# EAGLE design MFOS_NT_eurorack_v2 (EAGLE 7.3.0)
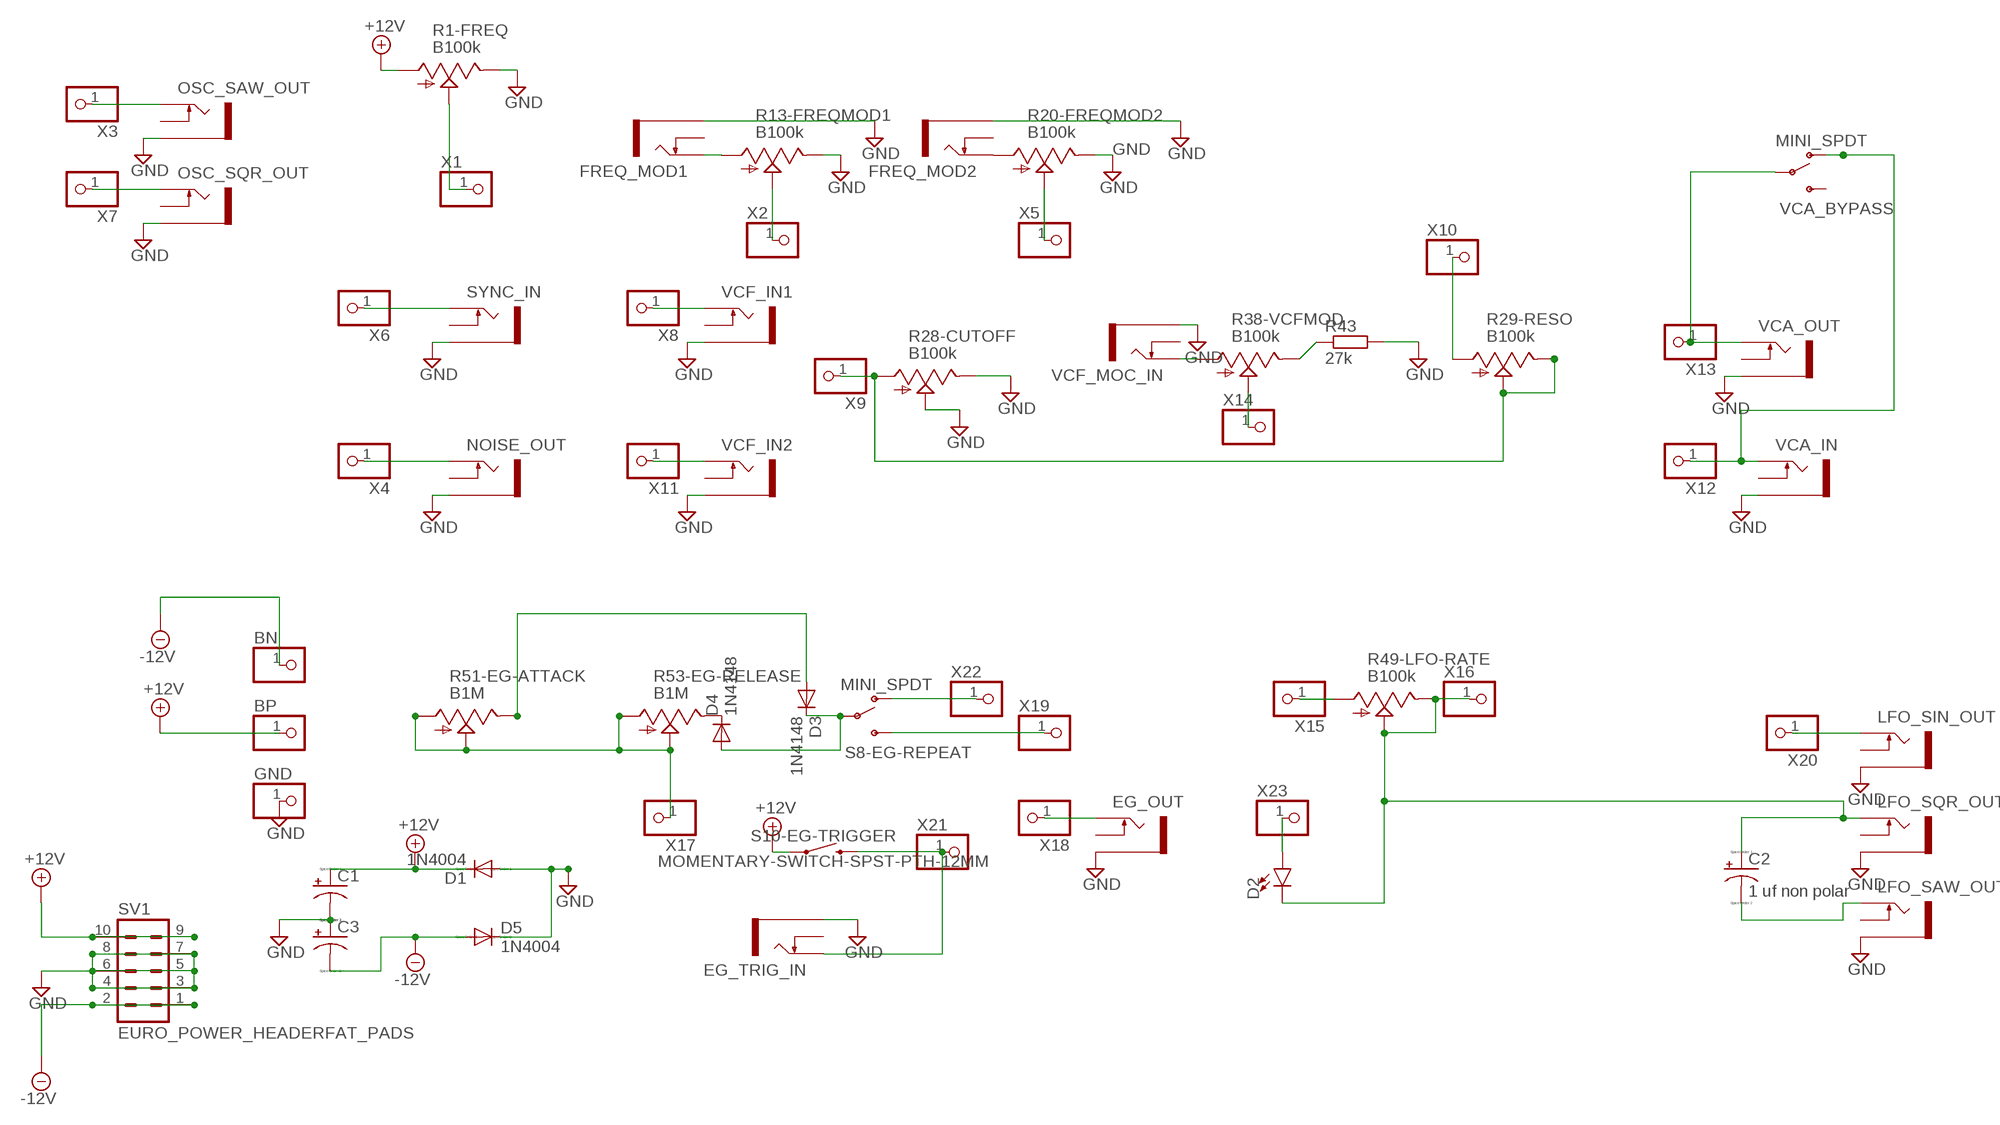
[diagram p0: schematic, sheet 1]

## Parts
BN  PINHD-1X1  [1X01]
BP  PINHD-1X1  [1X01]
C1  CPOL-USE2.5-7  [E2,5-7]
C2  1 uf non polar  CPOL-USTT2D5L  [TT2D5L]
C3  CPOL-USE2.5-7  [E2,5-7]
D1  1N4004  [DO41-10]
D2  LED3MM  [LED_3MM]
D3  1N4148  SMALL_DIODEDO35-7  [DO35-7]
D4  1N4148  SMALL_DIODEDO35-7  [DO35-7]
D5  1N4004  [DO41-10]
EG_OUT  THONKICONNNEW  [WQP-PJ301M-12_JACK]
EG_TRIG_IN  THONKICONNNEW  [WQP-PJ301M-12_JACK]
FREQ_MOD1  THONKICONNNEW  [WQP-PJ301M-12_JACK]
FREQ_MOD2  THONKICONNNEW  [WQP-PJ301M-12_JACK]
GND  PINHD-1X1  [1X01]
LFO_SAW_OUT  THONKICONNNEW  [WQP-PJ301M-12_JACK]
LFO_SIN_OUT  THONKICONNNEW  [WQP-PJ301M-12_JACK]
LFO_SQR_OUT  THONKICONNNEW  [WQP-PJ301M-12_JACK]
NOISE_OUT  THONKICONNNEW  [WQP-PJ301M-12_JACK]
OSC_SAW_OUT  THONKICONNNEW  [WQP-PJ301M-12_JACK]
OSC_SQR_OUT  THONKICONNNEW  [WQP-PJ301M-12_JACK]
R1-FREQ  B100k  9MM_SNAP-IN_POT_  [9MM_SNAP-IN_POT]
R13-FREQMOD1  B100k  9MM_SNAP-IN_POT_  [9MM_SNAP-IN_POT]
R20-FREQMOD2  B100k  9MM_SNAP-IN_POT_  [9MM_SNAP-IN_POT]
R28-CUTOFF  B100k  9MM_SNAP-IN_POT_  [9MM_SNAP-IN_POT]
R29-RESO  B100k  9MM_SNAP-IN_POT_  [9MM_SNAP-IN_POT]
R38-VCFMOD  B100k  9MM_SNAP-IN_POT_  [9MM_SNAP-IN_POT]
R43  27k  RESISTOR7MM  [7MM_RESISTOR]
R49-LFO-RATE  B100k  9MM_SNAP-IN_POT_  [9MM_SNAP-IN_POT]
R51-EG-ATTACK  B1M  9MM_SNAP-IN_POT_  [9MM_SNAP-IN_POT]
R53-EG-RELEASE  B1M  9MM_SNAP-IN_POT_  [9MM_SNAP-IN_POT]
S8-EG-REPEAT  MINI_SPDT  [MINI_SPDT_RIGHTANGLE]
S10-EG-TRIGGER  MOMENTARY-SWITCH-SPST-PTH-12MM  [TACTILE_SWITCH_PTH_12MM]
SV1  EURO_POWER_HEADERFAT_PADS  [EURO_PWR_HEADER_FAT]
SYNC_IN  THONKICONNNEW  [WQP-PJ301M-12_JACK]
VCA_BYPASS  MINI_SPDT  [MINI_SPDT_RIGHTANGLE]
VCA_IN  THONKICONNNEW  [WQP-PJ301M-12_JACK]
VCA_OUT  THONKICONNNEW  [WQP-PJ301M-12_JACK]
VCF_IN1  THONKICONNNEW  [WQP-PJ301M-12_JACK]
VCF_IN2  THONKICONNNEW  [WQP-PJ301M-12_JACK]
VCF_MOC_IN  THONKICONNNEW  [WQP-PJ301M-12_JACK]
X1  PINHD-1X1  [1X01]
X2  PINHD-1X1  [1X01]
X3  PINHD-1X1  [1X01]
X4  PINHD-1X1  [1X01]
X5  PINHD-1X1  [1X01]
X6  PINHD-1X1  [1X01]
X7  PINHD-1X1  [1X01]
X8  PINHD-1X1  [1X01]
X9  PINHD-1X1  [1X01]
X10  PINHD-1X1  [1X01]
X11  PINHD-1X1  [1X01]
X12  PINHD-1X1  [1X01]
X13  PINHD-1X1  [1X01]
X14  PINHD-1X1  [1X01]
X15  PINHD-1X1  [1X01]
X16  PINHD-1X1  [1X01]
X17  PINHD-1X1  [1X01]
X18  PINHD-1X1  [1X01]
X19  PINHD-1X1  [1X01]
X20  PINHD-1X1  [1X01]
X21  PINHD-1X1  [1X01]
X22  PINHD-1X1  [1X01]
X23  PINHD-1X1  [1X01]

## Nets
+12V: BP.1 C1.+ D1.C R1-FREQ.1(A) S10-EG-TRIGGER.1 SV1.9 SV1.10
-12V: BN.1 C3.- D5.A SV1.1 SV1.2
GND: C1.- C3.+ D1.A D5.C EG_OUT.P$3_SLEEVE(SLEEVE) EG_TRIG_IN.P$3_SLEEVE(SLEEVE) FREQ_MOD1.P$3_SLEEVE(SLEEVE) FREQ_MOD2.P$3_SLEEVE(SLEEVE) GND.1 LFO_SAW_OUT.P$3_SLEEVE(SLEEVE) LFO_SIN_OUT.P$3_SLEEVE(SLEEVE) LFO_SQR_OUT.P$3_SLEEVE(SLEEVE) NOISE_OUT.P$3_SLEEVE(SLEEVE) OSC_SAW_OUT.P$3_SLEEVE(SLEEVE) OSC_SQR_OUT.P$3_SLEEVE(SLEEVE) R1-FREQ.3(E) R13-FREQMOD1.3(E) R20-FREQMOD2.3(E) R28-CUTOFF.2(S) R28-CUTOFF.3(E) R43.2 SV1.3 SV1.4 SV1.5 SV1.6 SV1.7 SV1.8 SYNC_IN.P$3_SLEEVE(SLEEVE) VCA_IN.P$3_SLEEVE(SLEEVE) VCA_OUT.P$3_SLEEVE(SLEEVE) VCF_IN1.P$3_SLEEVE(SLEEVE) VCF_IN2.P$3_SLEEVE(SLEEVE) VCF_MOC_IN.P$3_SLEEVE(SLEEVE)
N$1: R1-FREQ.2(S) X1.1
N$3: FREQ_MOD1.P$1_TIP(TIP) R13-FREQMOD1.1(A)
N$4: FREQ_MOD2.P$1_TIP(TIP) R20-FREQMOD2.1(A)
N$5: R13-FREQMOD1.2(S) X2.1
N$6: R20-FREQMOD2.2(S) X5.1
N$7: SYNC_IN.P$1_TIP(TIP) X6.1
N$8: OSC_SAW_OUT.P$1_TIP(TIP) X3.1
N$9: OSC_SQR_OUT.P$1_TIP(TIP) X7.1
N$10: NOISE_OUT.P$1_TIP(TIP) X4.1
N$11: VCF_IN1.P$1_TIP(TIP) X8.1
N$12: VCF_IN2.P$1_TIP(TIP) X11.1
N$13: R28-CUTOFF.1(A) R29-RESO.2(S) R29-RESO.3(E) X9.1
N$14: R38-VCFMOD.3(E) R43.1
N$15: R29-RESO.1(A) X10.1
N$16: R38-VCFMOD.2(S) X14.1
N$17: R38-VCFMOD.1(A) VCF_MOC_IN.P$1_TIP(TIP)
N$18: VCA_BYPASS.UP(O) VCA_IN.P$1_TIP(TIP) X12.1
N$19: VCA_BYPASS.COMMON VCA_OUT.P$1_TIP(TIP) X13.1
N$20: EG_TRIG_IN.P$1_TIP(TIP) S10-EG-TRIGGER.3 X21.1
N$21: R51-EG-ATTACK.1(A) R51-EG-ATTACK.2(S) R53-EG-RELEASE.1(A) R53-EG-RELEASE.2(S) X17.1
N$22: D4.C R53-EG-RELEASE.3(E)
N$23: D3.C D4.A S8-EG-REPEAT.COMMON
N$24: S8-EG-REPEAT.DOWN(S) X19.1
N$25: D3.A R51-EG-ATTACK.3(E)
N$26: S8-EG-REPEAT.UP(O) X22.1
N$27: EG_OUT.P$1_TIP(TIP) X18.1
N$28: R49-LFO-RATE.1(A) X15.1
N$29: C2.+ D2.K(C) LFO_SQR_OUT.P$1_TIP(TIP) R49-LFO-RATE.2(S) R49-LFO-RATE.3(E) X16.1
N$30: C2.- LFO_SAW_OUT.P$1_TIP(TIP)
N$31: LFO_SIN_OUT.P$1_TIP(TIP) X20.1
N$32: D2.A X23.1
Unconnected: EG_OUT.P$2_SWITCH(SWITCH) EG_TRIG_IN.P$2_SWITCH(SWITCH) FREQ_MOD1.P$2_SWITCH(SWITCH) FREQ_MOD2.P$2_SWITCH(SWITCH) LFO_SAW_OUT.P$2_SWITCH(SWITCH) LFO_SIN_OUT.P$2_SWITCH(SWITCH) LFO_SQR_OUT.P$2_SWITCH(SWITCH) NOISE_OUT.P$2_SWITCH(SWITCH) OSC_SAW_OUT.P$2_SWITCH(SWITCH) OSC_SQR_OUT.P$2_SWITCH(SWITCH) SYNC_IN.P$2_SWITCH(SWITCH) VCA_BYPASS.DOWN(S) VCA_IN.P$2_SWITCH(SWITCH) VCA_OUT.P$2_SWITCH(SWITCH) VCF_IN1.P$2_SWITCH(SWITCH) VCF_IN2.P$2_SWITCH(SWITCH) VCF_MOC_IN.P$2_SWITCH(SWITCH)

## Library data of the parts
BN BP GND X1-X23 = pinhead:PINHD-1X1: PIN HEADER
C1-C3 = resistor:CPOL-US: POLARIZED CAPACITOR, American symbol
D1 D5 = diode:1N4004: DIODE general purpose rectifier, 1 A
D2 = SparkFun-LED:LED: LED (Generic) Standard schematic elements and footprints for 5mm, 3mm, 1206, and 0603 sized LEDs. Generic LEDs with no color specified.; PROD_ID: DIO-08794
D3 D4 = MusicThingModular:SMALL_DIODE: Small Signal Diode
EG_OUT EG_TRIG_IN FREQ_MOD1 FREQ_MOD2 LFO_SAW_OUT LFO_SIN_OUT LFO_SQR_OUT NOISE_OUT OSC_SAW_OUT OSC_SQR_OUT SYNC_IN VCA_IN VCA_OUT VCF_IN1 VCF_IN2 VCF_MOC_IN = MusicThingModular:THONKICONN: 3.5mm socket for Eurorack modular synths
R1-FREQ R13-FREQMOD1 R20-FREQMOD2 R28-CUTOFF R29-RESO R38-VCFMOD R49-LFO-RATE R51-EG-ATTACK R53-EG-RELEASE = MusicThingModular:9MM_SNAP-IN_POT: 9mm vertical snap-in pot, Alpha / Panasonic style
R43 = MusicThingModular:RESISTOR: Standard resistor, various versions
S8-EG-REPEAT VCA_BYPASS = MusicThingModular:MINI_SPDT
S10-EG-TRIGGER = SparkFun-Switches:MOMENTARY-SWITCH-SPST: Momentary Switch (Pushbutton) - SPST Normally-open (NO) SPST momentary switches (buttons, pushbuttons). Variants PTH-12MM - 12mm square, through-hole Momentary Pushbutton Switch - 12mm Square <https://www.sparkfun.com/products/9190> (COM-09190) PTH-6.0MM, PTH-6.0MM-KIT - 6.0mm square, through-hole Mini Pushbutton Switch <https://www.sparkfun.com/products/97> (COM-00097) KIT package intended for soldering kit's - only one side of pads' copper is exposed. PTH-RIGHT-ANGLE-KIT - Right-angle, through-hole Right Angle Tactile Button <https://www.sparkfun.com/products/10791> - Used on SparkFun BigTime Watch Kit <https://www.sparkfun.com/products/11734> SMD-12MM - 12mm square, surface-mount Tactile Button - SMD (12mm) <https://www.sparkfun.com/products/12993> (COM-12993) Used on SparkFun PicoBoard <https://www.sparkfun.com/products/11888> SMD-4.5MM - 4.5mm Square Trackball Switch Used on SparkFun Blackberry Trackballer Breakout <https://www.sparkfun.com/products/13169> SMD-4.6MMX2.8MM - 4.60mm x 2.80mm, surface mount Used on SparkFun SAMD21 Mini Breakout <https://www.sparkfun.com/products/13664> SMD-5.2MM, SMD-5.2-REDUNDANT - 5.2mm square, surface-mount Mini Pushbutton Switch - SMD <https://www.sparkfun.com/products/8720> (COM-08720) Used on Arduino Pro Mini <https://www.sparkfun.com/products/11114> REDUNDANT package connects both switch circuits together SMD-6.0X3.5MM - 6.0 x 3.5mm, surface mount Momentary Reset Switch SMD <https://www.sparkfun.com/products/8229> (COM-08229) SMD-6.2MM-TALL - 6.2mm square, surface mount Tactile Button - SMD (6mm) <https://www.sparkfun.com/products/12992> Used on SparkFun Digital Sandbox <https://www.sparkfun.com/products/12651> SMD-RIGHT-ANGLE - Right-angle, surface mount Used on SparkFun Block for Intel® Edison - Arduino <https://www.sparkfun.com/products/13036>; PROD_ID: SWCH-09185; SF_SKU: COM-09190
SV1 = MusicThingModular:EURO_POWER_HEADER: Power Header 10 pin power header for Eurorack Power Supplies Variants with fatter pads for easier soldering, and the LOCK variant which has 5mil offset pins to hold the component in place before soldering

## Net classes
0 default: width 0.305 mm, drill 0.203 mm, clearance 0.203 mm

## Board
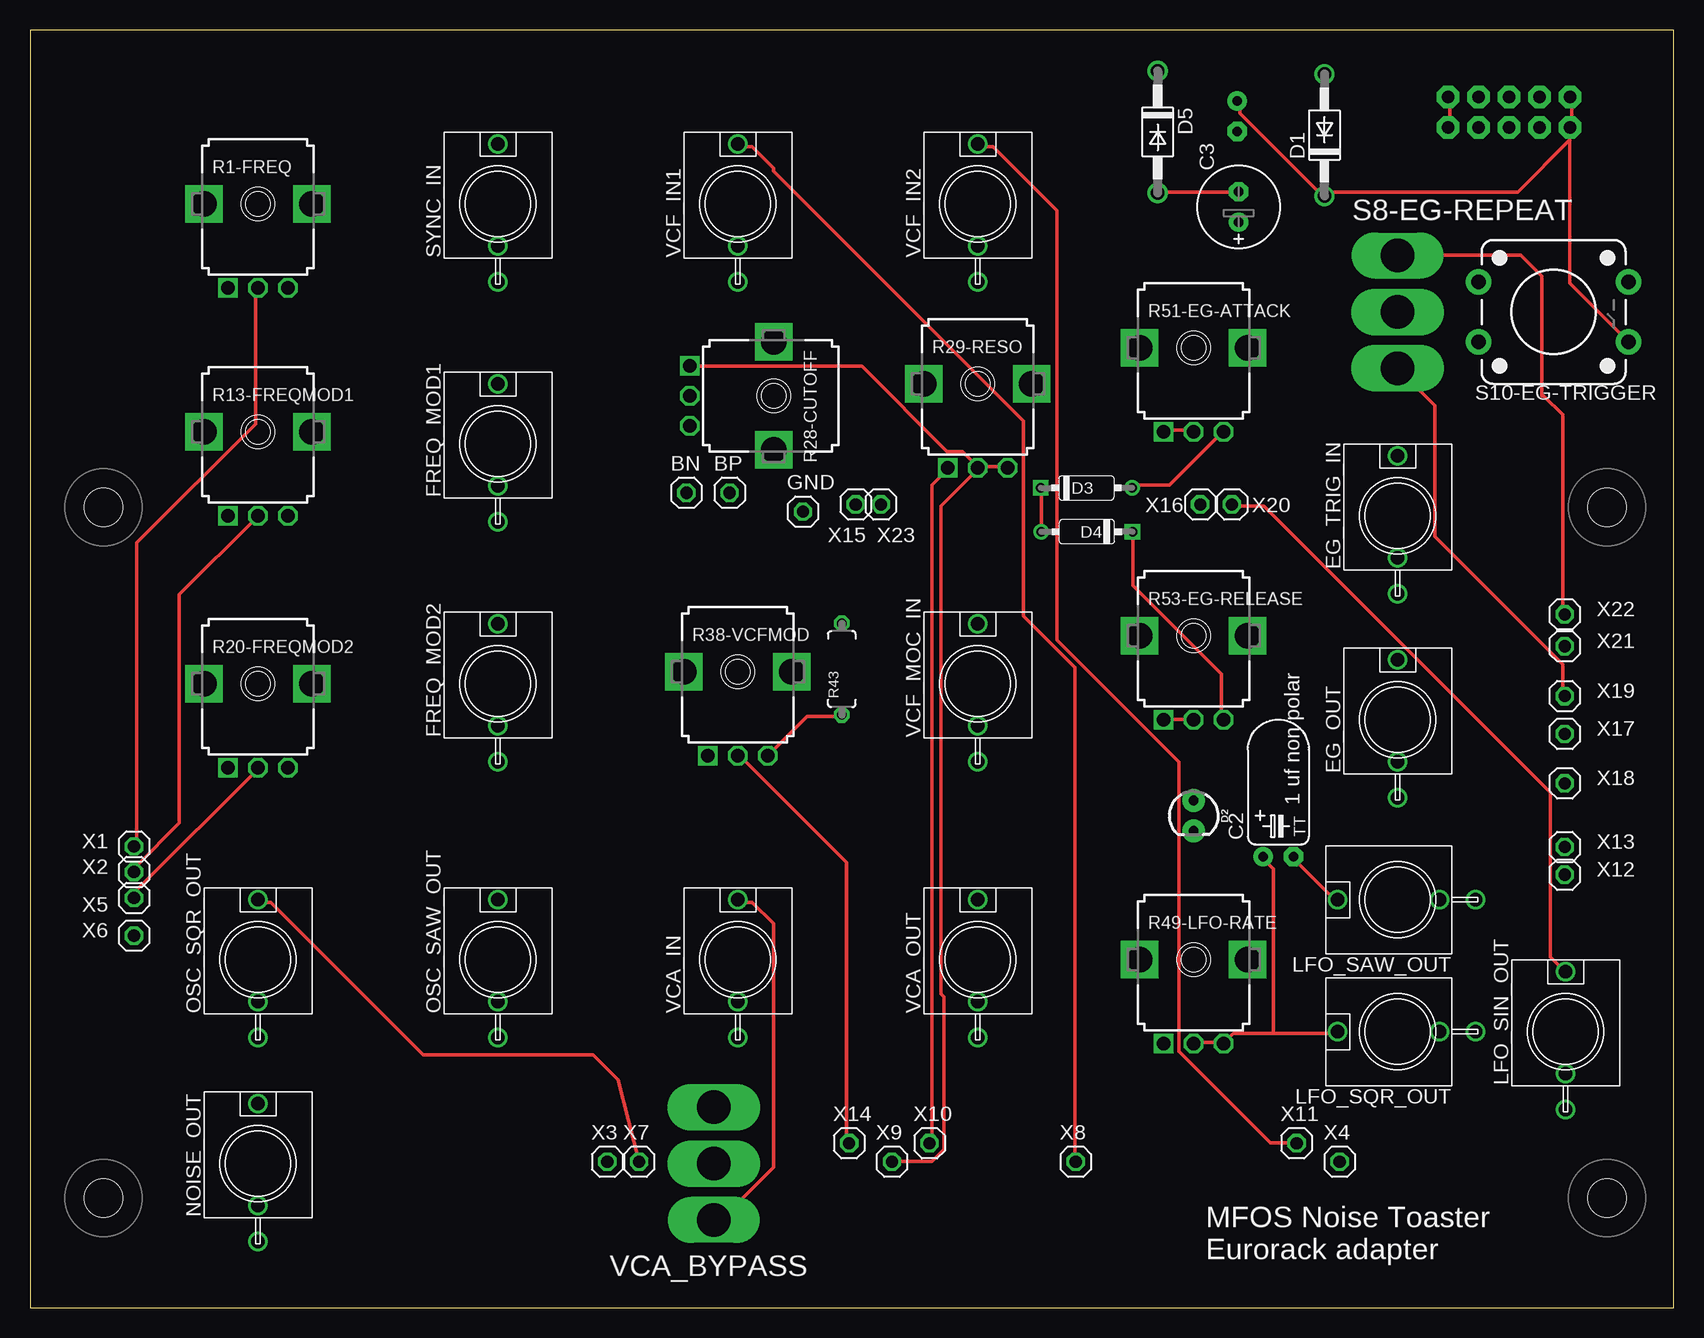
[diagram p1: board, top side]
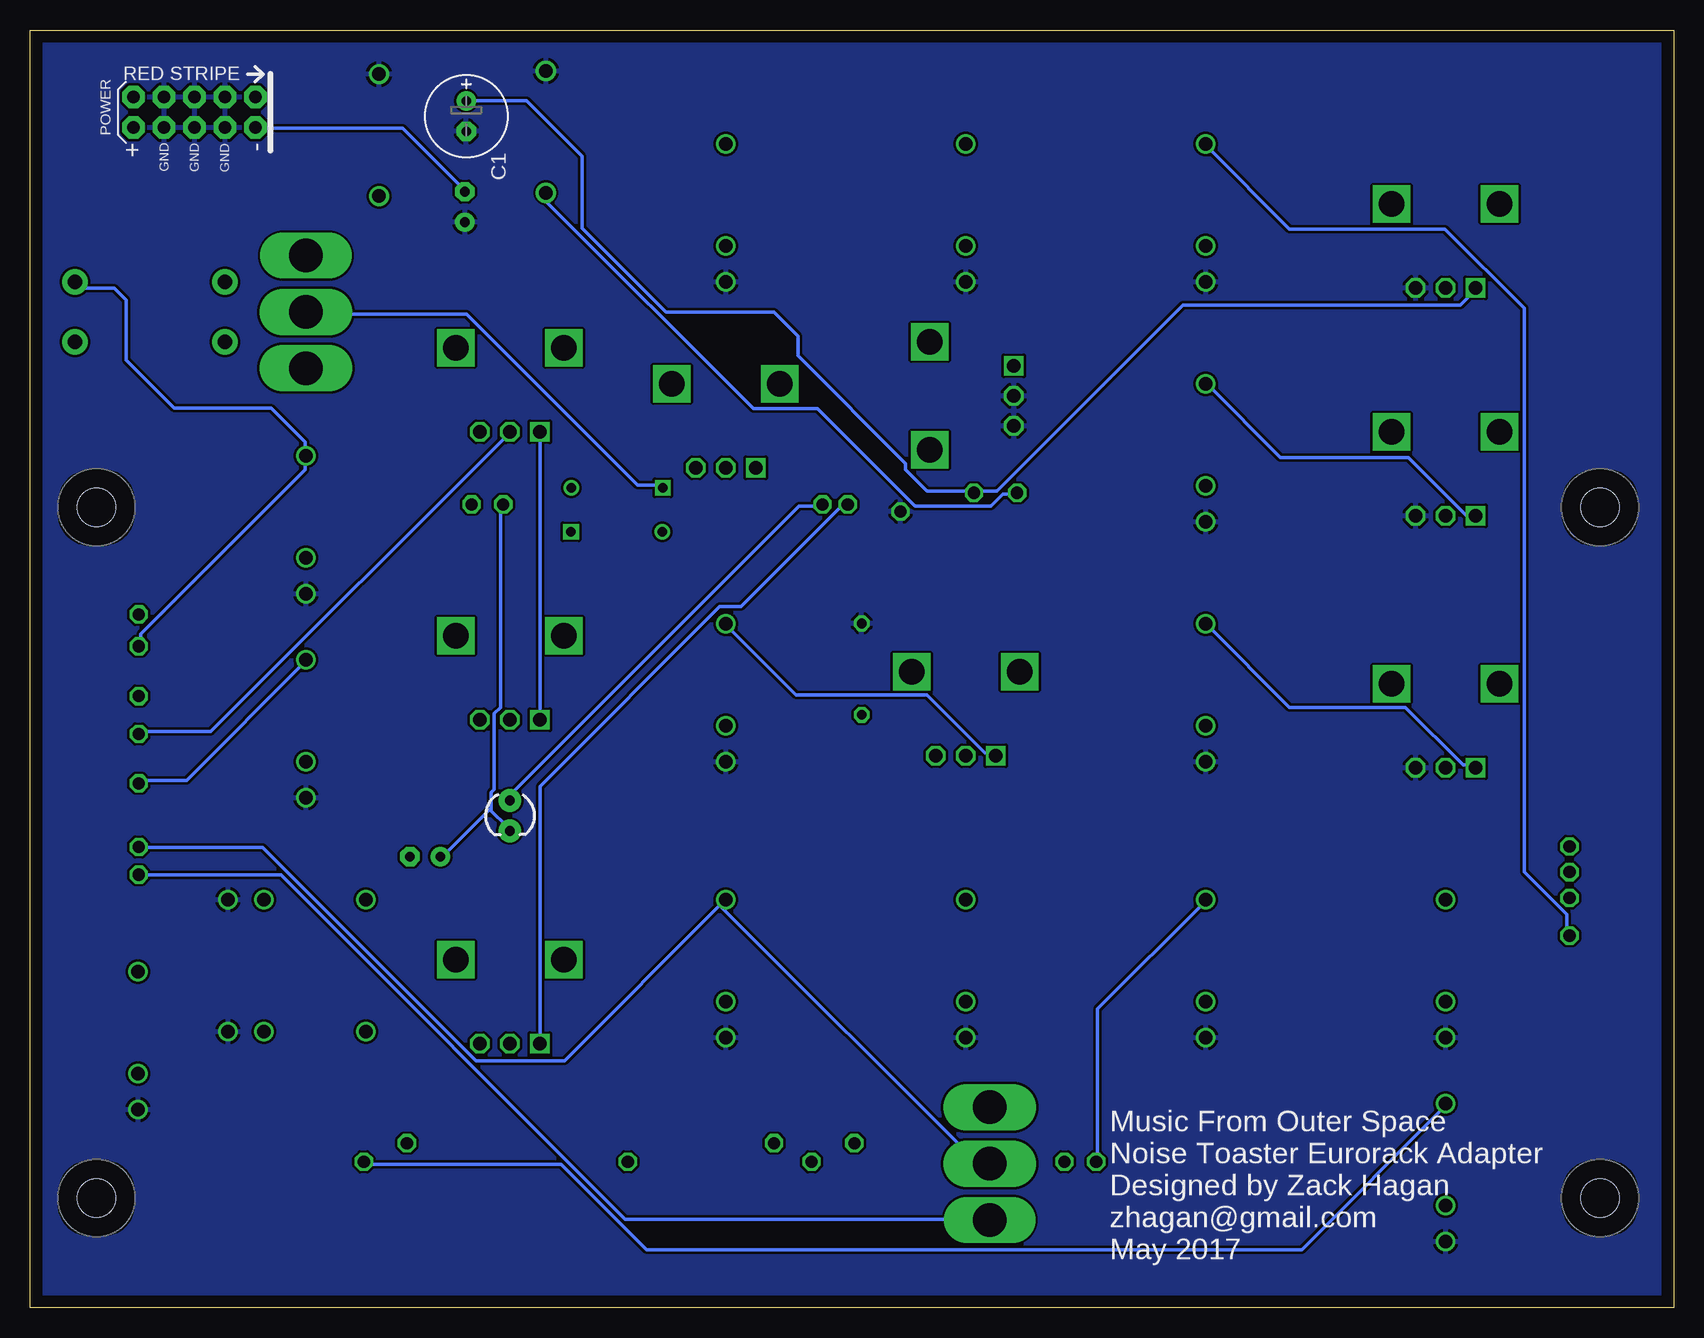
[diagram p2: board, bottom side, seen from below]

Size 137 x 106.5 mm. Coordinates in mm from the lower left corner, seen from the top.
Outline: 0,0 137,0 137,106.5 0,106.5 0,0
Copper layers (1*16): Top 0.035mm / dielectric 1.5mm / Bottom 0.035mm
Design rules "default": minimum track width 10mil, minimum drill 24mil, track to track 8mil, track to pad 8mil, pad to pad 8mil, via to via 8mil, smd to smd 8mil, copper to edge 40mil, drill to drill 8mil, minimum pad ring 10mil, minimum via ring 8mil, stop-mask expansion 4mil, vias tented up to drill 0mil, thermal gap 10mil

### Footprints (pad centres in the part's own frame; a part is rotated, then mirrored left to right if it is on the bottom)
1X01 = drill 1.016 octagon: 1 0,0
E2,5-7 = drill 0.813 pad 1.6: + -1.27,0 | drill 0.813 pad 1.6 octagon: - 1.27,0
TT2D5L = drill 0.813 pad 1.6: + -1.27,0 | drill 0.813 pad 1.6 octagon: - 1.27,0
DO41-10 = drill 1.118: A 5.08,0; C -5.08,0
LED_3MM = drill 0.813 pad 1.88: A -1.27,0; K 1.27,0
DO35-7 = drill 0.813: A 3.81,0 | drill 0.813 square: C -3.81,0
WQP-PJ301M-12_JACK = drill 1.1: P$1_TIP 0,5; P$2_SWITCH 0,-3.5; P$3_SLEEVE 0,-6.5
9MM_SNAP-IN_POT = drill 1.1 square: 1 -2.5,-7 | drill 1.1 octagon: 2 0,-7; 3 2.5,-7 | drill 2.1 square: CHASSIS1 -4.5,0; CHASSIS2 4.5,0
7MM_RESISTOR = drill 0.813 octagon: 1 -3.81,0; 2 3.81,0
MINI_SPDT_RIGHTANGLE = drill 2.8 pad 3.87 long: COMMON 0,0; DOWN 0,-4.7 | drill 2.8 pad 3.81 long: UP 0,4.7
TACTILE_SWITCH_PTH_12MM = drill 1.2 pad 2.159: 1 6.25,-2.5; 2 -6.25,-2.5; 3 6.25,2.5; 4 -6.25,2.5
EURO_PWR_HEADER_FAT = drill 1.016 pad 1.88 octagon: 1 -5.08,-1.27; 2 -5.08,1.27; 3 -2.54,-1.27; 4 -2.54,1.27; 5 0,-1.27; 6 0,1.27; 7 2.54,-1.27; 8 2.54,1.27; 9 5.08,-1.27; 10 5.08,1.27
MOUNTING_HOLE = hole 3.2: 0,0

### Placement (x,y rotation side)
BN  54.72,67.92 0 top
BP  58.32,67.92 0 top
C1  100.63,99.32 270 bottom
C2  104.06,37.59 0 top
C3  100.75,91.75 90 top
D1  107.91,97.74 90 top
D2  97,41 270 top
D3  88.06,68.33 0 top
D4  88.1,64.67 180 top
D5  94,98 270 top
EG_OUT  114,49 0 top
EG_TRIG_IN  114,66 0 top
FREQ_MOD1  39,72 0 top
FREQ_MOD2  39,52 0 top
GND  64.43,66.35 0 top
LFO_SAW_OUT  114,34 90 top
LFO_SIN_OUT  128,23 0 top
LFO_SQR_OUT  114,23 90 top
NOISE_OUT  19,12 0 top
OSC_SAW_OUT  39,29 0 top
OSC_SQR_OUT  19,29 0 top
R1-FREQ  19,92 0 top
R13-FREQMOD1  19,73 0 top
R20-FREQMOD2  19,52 0 top
R28-CUTOFF  62,76 270 top
R29-RESO  79,77 0 top
R38-VCFMOD  59,53 0 top
R43  67.67,53.22 90 top
R49-LFO-RATE  97,29 0 top
R51-EG-ATTACK  97,80 0 top
R53-EG-RELEASE  97,56 0 top
S8-EG-REPEAT  114,83 0 top
S10-EG-TRIGGER  127,83 0 top
SV1  123.29,99.64 180 bottom
SYNC_IN  39,92 0 top
U$1  [MOUNTING_HOLE]  6.13,9.13 0 top
U$2  [MOUNTING_HOLE]  131.47,9.13 0 top
U$3  [MOUNTING_HOLE]  131.47,66.7 0 top
U$4  [MOUNTING_HOLE]  6.13,66.7 0 top
VCA_BYPASS  57,12 180 top
VCA_IN  59,29 0 top
VCA_OUT  79,29 0 top
VCF_IN1  59,92 0 top
VCF_IN2  79,92 0 top
VCF_MOC_IN  79,52 0 top
X1  8.67,38.43 0 top
X2  8.67,36.3 0 top
X3  48.12,12.15 0 top
X4  109.17,12.15 0 top
X5  8.67,34.14 0 top
X6  8.67,31 0 top
X7  50.77,12.15 0 top
X8  87.17,12.15 0 top
X9  71.85,12.15 0 top
X10  74.98,13.7 0 top
X11  105.58,13.7 0 top
X12  127.93,36.08 0 top
X13  127.93,38.39 0 top
X14  68.28,13.7 0 top
X15  68.83,66.95 0 top
X16  97.55,66.95 0 top
X17  127.93,47.82 0 top
X18  127.93,43.7 0 top
X19  127.93,50.97 0 top
X20  100.19,66.95 0 top
X21  127.93,55.13 0 top
X22  127.93,57.78 0 top
X23  70.93,66.95 0 top

### Tracks (layer width: path | path; a pad name or v marks a point on that pad's centre or on a via)
+12V
  Top 0.305: C1.+ 100.84,100.58 100.84,99.57 107.7,92.71 D1.C 108.25,93 124,93 128.37,97.37 SV1.10 | SV1.10 128.52,98.55 128.52,100.84 SV1.9 | SV1.10 128.37,85.38 S10-EG-TRIGGER.1
  Bottom 0.305: R1-FREQ.1 16.51,84.84 17.78,83.57 40.89,83.57 56.39,68.07 58.17,68.07 BP.1 58.42,68.07 62.23,68.07 64.01,69.85 64.01,70.36 73,79.35 73,81 75,83 84,83 91,90 91,96 95.58,100.58 100.58,100.58 C1.+
-12V
  Top 0.305: SV1.2 118.36,98.55 118.36,100.84 SV1.1 | C3.- 100.58,92.96 94.23,92.96 D5.A
  Bottom 0.305: BN.1 54.86,67.82 55.88,67.82 56.9,66.8 63.25,66.8 71.37,74.93 76.71,74.93 93.98,92.2 93.98,92.71 D5.A | SV1.2 118.11,98.3 105.92,98.3 100.84,93.22 C3.-
GND
  pour Bottom: -1,108 -2,108 -2,-3 140,-3 140,108
N$1
  Top 0.305: X1.1 8.89,38.61 8.89,63.75 18.8,73.66 18.8,84.84 R1-FREQ.2
N$3
  Bottom 0.305: R13-FREQMOD1.1 16.51,66.04 17.27,66.04 22.1,70.87 32.77,70.87 38.86,76.96 FREQ_MOD1.P$1_TIP
N$4
  Bottom 0.305: R20-FREQMOD2.1 16.51,45.21 17.53,45.21 22.35,50.04 32,50.04 38.86,56.9 FREQ_MOD2.P$1_TIP
N$5
  Top 0.305: X2.1 8.89,36.32 8.89,36.83 12.45,40.39 12.45,59.44 18.8,65.79 R13-FREQMOD1.2
N$6
  Top 0.305: X5.1 8.89,34.29 8.89,34.8 19.05,44.96 R20-FREQMOD2.2
N$7
  Bottom 0.305: X6.1 8.89,31.24 8.89,32.77 12.45,36.32 12.45,83.31 19.05,89.92 32,89.92 38.86,96.77 SYNC_IN.P$1_TIP
N$8
  Bottom 0.305: X3.1 48.01,12.19 48.01,24.89 39.12,33.78 OSC_SAW_OUT.P$1_TIP
N$9
  Top 0.305: OSC_SQR_OUT.P$1_TIP 19.05,33.78 20.07,33.78 32.77,21.08 46.92,21.08 49,19 X7.1
N$10
  Bottom 0.305: X4.1 108.97,11.94 92.71,11.94 85.6,4.83 30.99,4.83 19.05,16.76 NOISE_OUT.P$1_TIP
N$11
  Top 0.305: X8.1 87.12,12.19 87.12,53.34 82.8,57.66 82.8,73.91 61.98,94.74 61.98,95 60.2,96.77 59.18,96.77 VCF_IN1.P$1_TIP
N$12
  Top 0.305: X11.1 105.41,13.72 103.38,13.72 95.76,21.34 95.76,45.47 85.6,55.63 85.6,91.44 80.26,96.77 79.25,96.77 VCF_IN2.P$1_TIP
N$13
  Top 0.305: X9.1 71.88,12.19 75.18,12.19 76.2,13.21 76.2,25.91 75.95,26.16 75.95,66.8 78.99,69.85 R29-RESO.2 | R29-RESO.3 81.28,70.1 79.25,70.1 R29-RESO.2 | R28-CUTOFF.1 55.12,78.49 69.34,78.49 76.45,71.37 77.72,71.37 78.99,70.1 R29-RESO.2
N$14
  Top 0.305: R43.1 67.56,49.28 64.77,49.28 61.72,46.23 R38-VCFMOD.3
N$15
  Top 0.305: X10.1 75.18,13.72 75.18,68.58 76.45,69.85 R29-RESO.1
N$16
  Top 0.305: X14.1 68.07,13.72 68.07,37.08 59.18,45.97 R38-VCFMOD.2
N$17
  Bottom 0.305: R38-VCFMOD.1 56.64,46.23 57.4,46.23 62.23,51.05 73.15,51.05 78.99,56.9 VCF_MOC_IN.P$1_TIP
N$18
  Top 0.305: VCA_IN.P$1_TIP 59.18,33.78 60.2,33.78 61.98,32 61.98,11.68 57.66,7.37 57.15,7.37 VCA_BYPASS.UP
  Bottom 0.305: X12.1 127.76,36.07 116.08,36.07 87.38,7.37 57.15,7.37 VCA_BYPASS.UP
N$19
  Bottom 0.305: 79.5,33.53 79.25,33.78 VCA_OUT.P$1_TIP 79.5,33.53 | 79.5,33.53 92.46,20.57 99.82,20.57 117.6,38.35 127.76,38.35 X13.1 | 79.5,33.53 58.17,12.19 57.15,12.19 VCA_BYPASS.COMMON
N$20
  Bottom 0.305: X21.1 127.76,55.37 127.76,56.13 114.05,69.85 114.05,70.87 EG_TRIG_IN.P$1_TIP 114.05,71.12 114.05,72.14 116.91,75 125,75 129,79 129,84 130,85 133,85 133.25,85.25 S10-EG-TRIGGER.3
N$21
  Top 0.305: R53-EG-RELEASE.1 94.74,49.02 96.77,49.02 R53-EG-RELEASE.2 | R51-EG-ATTACK.1 94.74,73.15 96.77,73.15 R51-EG-ATTACK.2
  Bottom 0.305: X17.1 127.76,48.01 121.92,48.01 97.03,72.9 R51-EG-ATTACK.2 | R53-EG-RELEASE.1 94.49,49.02 94.49,72.9 R51-EG-ATTACK.1
N$22
  Top 0.305: D4.C 91.95,64.52 91.95,60.2 99.31,52.83 99.31,49.02 R53-EG-RELEASE.3
N$23
  Top 0.305: D4.A 84.33,64.77 84.33,68.33 D3.C
  Bottom 0.305: D3.C 84.33,68.58 86.36,68.58 100.58,82.8 113.79,82.8 S8-EG-REPEAT.COMMON
N$24
  Top 0.305: X19.1 127.76,51.05 127.76,53.59 117.09,64.26 117.09,75.18 114.05,78.23 S8-EG-REPEAT.DOWN
N$25
  Top 0.305: D3.A 91.95,68.58 95,68.58 99.31,72.9 R51-EG-ATTACK.3
N$26
  Top 0.305: X22.1 127.76,57.91 127.76,74.42 126.18,76 126,76 126,86 124.25,87.75 114.55,87.75 114.55,87.63 114.05,87.63 S8-EG-REPEAT.UP
N$27
  Bottom 0.305: X18.1 127.76,43.94 123.95,43.94 114.05,53.85 EG_OUT.P$1_TIP
N$28
  Bottom 0.305: X15.1 68.83,66.8 69.34,66.8 77.72,58.42 79.5,58.42 94.49,43.43 94.49,22.1 R49-LFO-RATE.1
N$29
  Top 0.305: R49-LFO-RATE.2 97.03,22.1 99.31,22.1 R49-LFO-RATE.3 99.57,22.1 100.33,22.86 103.63,22.86 | 103.63,22.86 108.97,22.86 LFO_SQR_OUT.P$1_TIP | 103.63,22.86 103.63,36.58 102.87,37.34 C2.+
  Bottom 0.305: 98.55,41.66 98.55,41.4 97.28,40.13 D2.K | 98.55,41.66 98.55,42.93 98.3,43.18 98.3,49.53 97.79,50.04 97.79,66.8 X16.1 | 98.55,41.66 102.62,37.59 C2.+
N$30
  Top 0.305: C2.- 105.41,37.34 108.97,33.78 LFO_SAW_OUT.P$1_TIP
N$31
  Top 0.305: X20.1 100.33,66.8 102.87,66.8 126.75,42.93 126.75,29.21 127.76,28.19 LFO_SIN_OUT.P$1_TIP
N$32
  Bottom 0.305: X23.1 71.12,66.8 72.9,66.8 97.03,42.67 D2.A

### Text on the board
tNames: MFOS Noise Toaster / Eurorack adapter
bNames: Music From Outer Space / Noise Toaster Eurorack Adapter / Designed by Zack Hagan / zhagan@gmail.com / May 2017